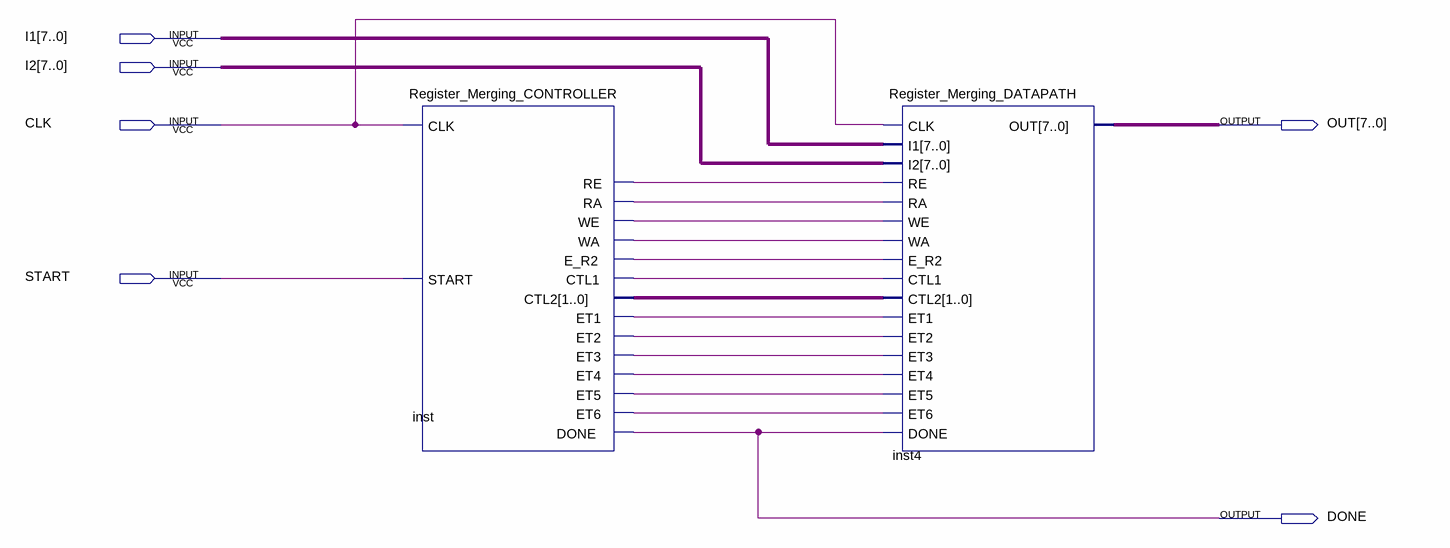
[diagram p0: schematic sheet]
// Quartus schematic Register_Merging.bdf as structural Verilog: 2 symbols, 6 pins
module Register_Merging (
  input  [7:0] I1,
  input  [7:0] I2,
  input  CLK,
  input  START,
  output [7:0] OUT,
  output DONE
);

  wire inst_ctl1, inst_e_r2, inst_et1, inst_et2, inst_et3, inst_et4, inst_et5, inst_et6, inst_ra, inst_re,
       inst_wa, inst_we;
  wire [1:0] inst_ctl2;

  Register_Merging_CONTROLLER inst (
    .CLK(CLK), .START(START), .RE(inst_re), .RA(inst_ra), .WE(inst_we), .WA(inst_wa), .E_R2(inst_e_r2),
    .CTL1(inst_ctl1), .CTL2(inst_ctl2), .ET1(inst_et1), .ET2(inst_et2), .ET3(inst_et3), .ET4(inst_et4),
    .ET5(inst_et5), .ET6(inst_et6), .DONE(DONE));
  Register_Merging_DATAPATH inst4 (
    .CLK(CLK), .I1(I1), .I2(I2), .WA(inst_wa), .WE(inst_we), .RA(inst_ra), .RE(inst_re), .E_R2(inst_e_r2),
    .CTL1(inst_ctl1), .CTL2(inst_ctl2), .ET1(inst_et1), .ET2(inst_et2), .ET3(inst_et3), .ET4(inst_et4),
    .ET5(inst_et5), .ET6(inst_et6), .DONE(DONE), .OUT(OUT));
endmodule
